# EAGLE design Lora Relay v1.1 (EAGLE 6.1)
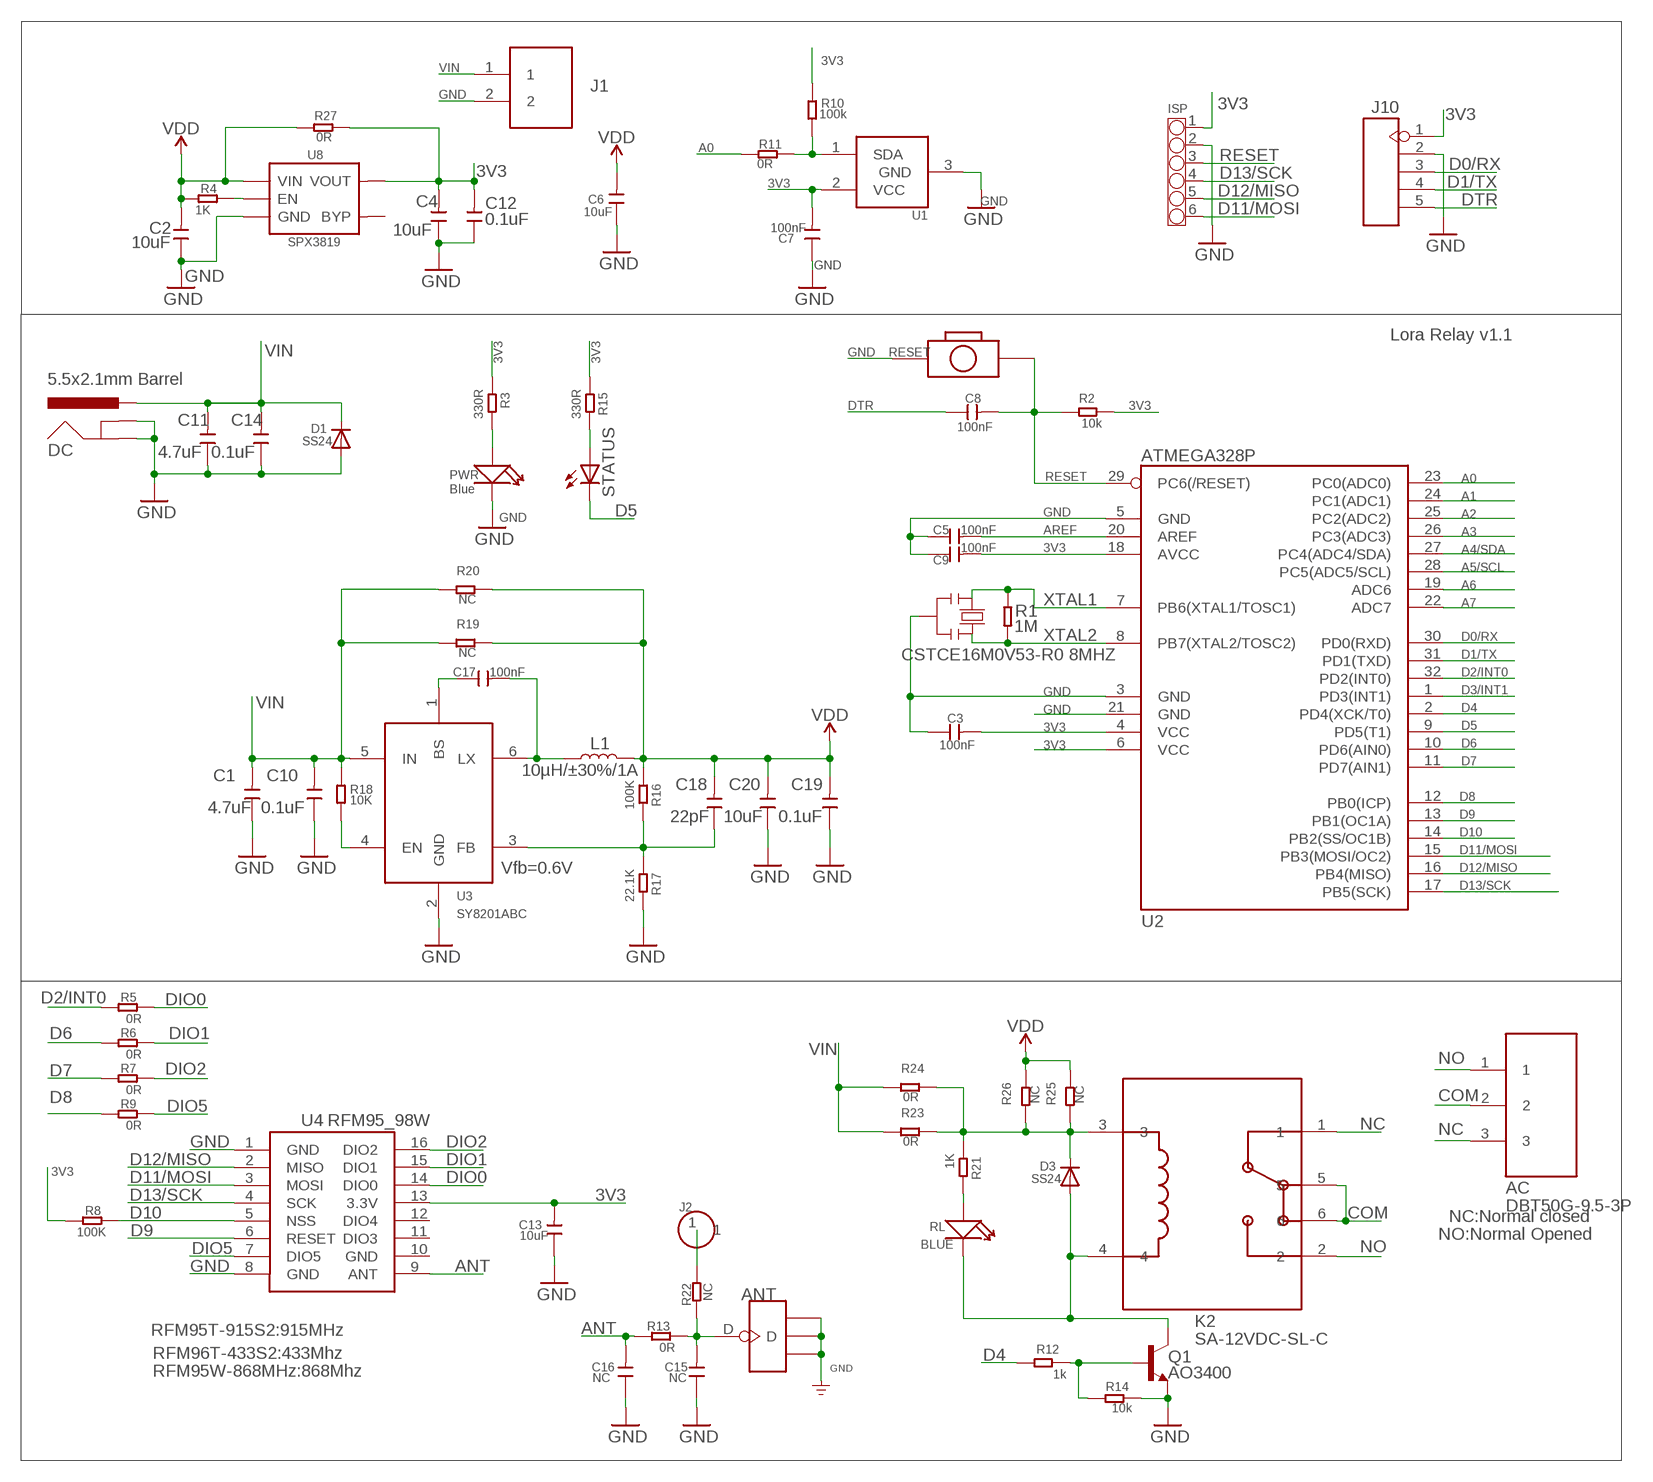
[diagram p0: schematic, sheet 1]

## Parts
AC  DBT50G-9.5-3P  [THROUGH-HOLE-9.5]
ANT  ANTENNA-U-FL  [4P-U-FL]
C1  4.7uF  C-0603  [0603]
C2  10uF  C-0603  [0603]
C3  100nF  C-0603  [0603]
C4  10uF  C-0603  [0603]
C5  100nF  C-0603  [0603]
C6  10uF  C-0603  [0603]
C7  100nF  C-0603  [0603]
C8  100nF  C-0603  [0603]
C9  100nF  C-0603  [0603]
C10  0.1uF  C-0603  [0603]
C11  4.7uF  C-0603  [0603]
C12  0.1uF  C-0603  [0603]
C13  10uF  C-0603  [0603]
C14  0.1uF  C-0603  [0603]
C15  NC  C-0603  [0603]
C16  NC  C-0603  [0603]
C17  100nF  C-0603  [0603]
C18  22pF  C-0603  [0603]
C19  0.1uF  C-0603  [0603]
C20  10uF  C-0603  [0603]
D1  SS24  DIODESMA  [SMADIODE]
D3  SS24  DIODESMA  [SMADIODE]
DC  5.5x2.1mm Barrel  POWER_JACKSMD  [POWER_JACK_SMD]
ISP  CONNECTOR-HEADER-6P-3460270P1  [1X6P-2.54-8.5-BLACK-FEMALE]
J1  PH2.0-2P-90-DIP  [PH2.0-2P-90-DIP]
J2  HEADER-1P-50  [1P-100/50MIL]
J10  HEADER-5P-2.54  [5P-2.54]
K2  SA-12VDC-SL-C  [THROUGH-HOLE]
L1  10µH/±30%/1A  INDUCTOR-CR54-47UH  [CR54]
PWR  Blue  LED'0603'  [LED-0603]
Q1  AO3400  TRANS_NPN-MMBT2222AL  [SOT23-3]
R1  1M  R-0603  [R0603]
R2  10k  R-0603  [R0603]
R3  330R  R-0603  [R0603]
R4  1K  R-0603  [R0603]
R5  0R  R-0603  [R0603]
R6  0R  R-0603  [R0603]
R7  0R  R-0603  [R0603]
R8  100K  R-0603  [R0603]
R9  0R  R-0603  [R0603]
R10  100k  R-0603  [R0603]
R11  0R  R-0603  [R0603]
R12  1k  R-0603  [R0603]
R13  0R  R-0603  [R0603]
R14  10k  R-0603  [R0603]
R15  330R  R-0603  [R0603]
R16  100K  R-0603  [R0603]
R17  22.1K  R-0603  [R0603]
R18  10K  R-0603  [R0603]
R19  NC  R-0603  [R0603]
R20  NC  R-0603  [R0603]
R21  1K  R-0603  [R0603]
R22  NC  R-0603  [R0603]
R23  0R  R-0603  [R0603]
R24  0R  R-0603  [R0603]
R25  NC  R-0603  [R0603]
R26  NC  R-0603  [R0603]
R27  0R  R-0603  [R0603]
RESET  BOTTON-2P-90D  [2P-7.62X3.56-90D]
RL  BLUE  LED'0603'  [LED-0603]
STATUS  LED5MM  [LED5MM]
U1  IC_ATSHA204A_CRYPT  [SOT23-3]
U2  ATMEGA328P  ATMEGA8/168/328  [TQFP32]
U3  SY8201ABC  [SOT-23-6]
U4  RFM95_98W  RFM92_93W  [RFM92_93W]
U8  SPX3819  [SOT23-5]
Y1  CSTCE16M0V53-R0 8MHZ  RESONATORMU  [RESONATOR]

## Nets
3V3: C3.2 C4.2 C7.2 C9.2 C12.2 C13.2 ISP.1 J10.1 R2.1 R3.1 R8.2 R10.1 R15.1 R27.2 U1.2(VCC) U2.4(VCC) U2.6(VCC) U2.18(AVCC) U4.13(3.3V) U8.5(VOUT)
A0: R11.1 U2.23(PC0(ADC0))
A1: U2.24(PC1(ADC1))
A2: U2.25(PC2(ADC2))
A3: U2.26(PC3(ADC3))
A4/SDA: U2.27(PC4(ADC4/SDA))
A5/SCL: U2.28(PC5(ADC5/SCL))
A6: U2.19(ADC6)
A7: U2.22(ADC7)
ANT: C16.2 R13.2 U4.9(ANT)
AREF: C5.2 U2.20(AREF)
COM: AC.2 K2.5 K2.6
D0/RX: J10.3 U2.30(PD0(RXD))
D1/TX: J10.4 U2.31(PD1(TXD))
D2/INT0: R5.1 U2.32(PD2(INT0))
D3/INT1: U2.1(PD3(INT1))
D4: R12.2 U2.2(PD4(XCK/T0))
D5: STATUS.K(C) U2.9(PD5(T1))
D6: R6.1 U2.10(PD6(AIN0))
D7: R7.1 U2.11(PD7(AIN1))
D8: R9.1 U2.12(PB0(ICP))
D9: U2.13(PB1(OC1A)) U4.6(RESET)
D10: R8.1 U2.14(PB2(SS/OC1B)) U4.5(NSS)
D11/MOSI: ISP.6 U2.15(PB3(MOSI/OC2)) U4.3(MOSI)
D12/MISO: ISP.5 U2.16(PB4(MISO)) U4.2(MISO)
D13/SCK: ISP.4 U2.17(PB5(SCK)) U4.4(SCK)
DIO0: R5.2 U4.14(DIO0)
DIO1: R6.2 U4.15(DIO1)
DIO2: R7.2 U4.16(DIO2)
DIO5: R9.2 U4.7(DIO5)
DTR: C8.1 J10.5
GND: ANT.GND1 ANT.GND2 ANT.GND3 C1.1 C2.1 C3.1 C4.1 C5.1 C6.1 C7.1 C9.1 C10.1 C11.1 C12.1 C13.1 C14.1 C15.1 C16.1 C19.1 C20.1 D1.A DC.GND(GNDBREAK) DC.P$4(GND) ISP.2 J1.2 J10.2 PWR.- Q1.2(E) R14.2 R17.2 RESET.P$1 U1.3(GND) U2.3(GND) U2.5(GND) U2.21(GND) U3.2(GND) U4.1(GND) U4.8(GND) U8.2(GND) Y1.2
N$1: D3.A K2.4 Q1.3(C) RL.-
N$2: R10.2 R11.2 U1.1(SDA)
N$3: Q1.1(B) R12.1 R14.1
N$4: ANT.D C15.2 R13.1 R22.2
N$5: R15.2 STATUS.A
N$6: C17.2 L1.P$1 U3.6(LX)
N$7: PWR.+ R3.2
N$8: C17.1 U3.1(BS)
N$9: R21.2 RL.+
N$10: C18.1 R16.2 R17.1 U3.3(FB)
N$11: R18.2 U3.4(EN)
N$12: J2.1 R22.1
N$13: D3.C K2.3 R21.1 R23.2 R24.2 R25.1 R26.1
N$24: R4.2 U8.3(EN)
NC: AC.3 K2.1
NO: AC.1 K2.2
RESET: C8.2 ISP.3 R2.2 RESET.P$2 U2.29(PC6(/RESET))
VDD: C2.2 C6.2 C18.2 C19.2 C20.2 L1.P$2 R4.1 R16.1 R19.2 R20.2 R25.2 R26.2 R27.1 U8.1(VIN)
VIN: C1.2 C10.2 C11.2 C14.2 D1.C DC.VIN0(PWR) J1.1 R18.1 R19.1 R20.1 R23.1 R24.1 U3.5(IN)
XTAL1: R1.2 U2.7(PB6(XTAL1/TOSC1)) Y1.1
XTAL2: R1.1 U2.8(PB7(XTAL2/TOSC2)) Y1.3
Unconnected: U4.11(DIO3) U4.12(DIO4) U8.4(BYP)

## Notes on the sheet
- J1
- Lora Relay v1.1
- Vfb=0.6V
- NC:Normal closed
- NO:Normal Opened
- RFM95T-915S2:915MHz
- RFM96T-433S2:433Mhz
- RFM95W-868MHz:868Mhz

## Power pins joined to a net without a drawn wire
GND: U4.10(GND)

## Library data of the parts
AC = self:DBT50G-9.5-3P
ANT = Connector:ANTENNA-U-FL
C1-C20 = Discrete:C*: Ceramic Capacitors
D1 D3 = adafruit:DIODE: Diode SMADIODE - SMA Surface Mount Package 20V 1A Schottky Diode Digikey: 641-1014-6-ND DO-1N4148 - Through Hole Small Current Diode SOD-123 20V 1 A (.5mV Vf) Schottky Diode - Digikey: MBRX120TPMSCT-ND SOD-323 10V 570mA (.38mV Vf, 3ns) Schottky Diode - Digikey: ZLLS410CT-ND SOD-523 30V 30mA Schottky Diode (RB751S-40TE61) - Digikey: RB751S-40TE61CT-ND SOT23-R/W - SOT23 Package (R = Solder Paste/Reflow Ovens, W = Hand-Soldering) BAT54Film 40V 300mA - Digikey: 497-7162-1-ND
DC = SparkFun-Connectors:POWER_JACK: Power Jack Connector This is the standard 5.5mm barrel jack for power. The PTH is the most common, proven, reliable, footprint. The Slot footprint only works if the mill layer is transmitted to the PCB fab house so be warned. Here are the connectors we sell at SparkFun: DC Barrel Power Jack/Connector <https://www.sparkfun.com/products/119> (PRT-00119) DC Barrel Power Jack/Connector (SMD) <https://www.sparkfun.com/products/12748> (PRT-12748) DC Barrel Jack Adapter - Breadboard Compatible <https://www.sparkfun.com/products/10811> (PRT-10811) It is used on this SparkFun product (and many, many others): SparkFun RedBoard - Programmed with Arduino <https://www.sparkfun.com/products/12757> (DEV-12757) Also, if you need a mating power supply or connector, please check these out: Wall Adapter Power Supply - 9VDC 650mA <https://www.sparkfun.com/products/298> (TOL-00298) DC Barrel Jack Adapter - Male <https://www.sparkfun.com/products/10287> (PRT-10287); PROD_ID: CONN-08106; SF_ID: PRT-12748
ISP = OPL Eagle Library:CONNECTOR-HEADER-6P
J1 = Connector:PH2.0-2P-90-DIP
J2 = Connector:HEADER-1P
J10 = Connector:HEADER-5P
K2 = self:SA-12VDC-SL-C
L1 = SparkFun-Coils:INDUCTOR: Inductors Resist changes in electrical current. Basically a coil of wire. SparkFun Products: SparkFun Load Cell Amplifier - HX711 <https://www.sparkfun.com/products/13879> IOIO-OTG - V2.2 <https://www.sparkfun.com/products/13613>; PROD_ID: NDUC-10789; VALUE: 47µH/±30%/750mA
PWR RL = Discrete:LED*
Q1 = SparkFun-DiscreteSemi:TRANS_NPN: NPN transistor Current controlled devices typically used to amplify current or used as a switch. BC547 - COM-08928 <http://www.sparkfun.com/products/8928> (TO-92 45V 100mA) (1.Collector 2.Base 3.Emitter) 2N3904 - COM-00521 <http://www.sparkfun.com/products/521> (TO-92 40V 200mA) (1.Emitter 2.Base 3.Collector) P2N2222A - COM-12852 <http://www.sparkfun.com/products/12852> (TO-92 40V 600mA) (1.Collector 2.Base 3.Emitter); PROD_ID: TRANS-08049; VALUE: 600mA/40V
R1-R27 = Discrete:R*
RESET = Discrete:BOTTON-2P
STATUS = led:LED: LED OSRAM: - CHIPLED LG R971, LG N971, LY N971, LG Q971, LY Q971, LO R971, LY R971 LH N974, LH R974 LS Q976, LO Q976, LY Q976 LO Q996 - Hyper CHIPLED LW Q18S LB Q993, LB Q99A, LB R99A - SideLED LS A670, LO A670, LY A670, LG A670, LP A670 LB A673, LV A673, LT A673, LW A673 LH A674 LY A675 LS A676, LA A676, LO A676, LY A676, LW A676 LS A679, LY A679, LG A679 - Hyper Micro SIDELED® LS Y876, LA Y876, LO Y876, LY Y876 LT Y87S - SmartLED LW L88C, LW L88S LB L89C, LB L89S, LG L890 LS L89K, LO L89K, LY L89K LS L896, LA L896, LO L896, LY L896 - TOPLED LS T670, LO T670, LY T670, LG T670, LP T670 LSG T670, LSP T670, LSY T670, LOP T670, LYG T670 LG T671, LOG T671, LSG T671 LB T673, LV T673, LT T673, LW T673 LH T674 LS T676, LA T676, LO T676, LY T676, LB T676, LH T676, LSB T676, LW T676 LB T67C, LV T67C, LT T67C, LS T67K, LO T67K, LY T67K, LW E67C LS E67B, LA E67B, LO E67B, LY E67B, LB E67C, LV E67C, LT E67C LW T67C LS T679, LY T679, LG T679 LS T770, LO T770, LY T770, LG T770, LP T770 LB T773, LV T773, LT T773, LW T773 LH T774 LS E675, LA E675, LY E675, LS T675 LS T776, LA T776, LO T776, LY T776, LB T776 LHGB T686 LT T68C, LB T68C - Hyper Mini TOPLED® LB M676 - Mini TOPLED Santana® LG M470 LS M47K, LO M47K, LY M47K Source: http://www.osram.convergy.de LUXEON: - LUMILED® LXK2-PW12-R00, LXK2-PW12-S00, LXK2-PW14-U00, LXK2-PW14-V00 LXK2-PM12-R00, LXK2-PM12-S00, LXK2-PM14-U00 LXK2-PE12-Q00, LXK2-PE12-R00, LXK2-PE12-S00, LXK2-PE14-T00, LXK2-PE14-U00 LXK2-PB12-K00, LXK2-PB12-L00, LXK2-PB12-M00, LXK2-PB14-N00, LXK2-PB14-P00, LXK2-PB14-Q00 LXK2-PR12-L00, LXK2-PR12-M00, LXK2-PR14-Q00, LXK2-PR14-R00 LXK2-PD12-Q00, LXK2-PD12-R00, LXK2-PD12-S00 LXK2-PH12-R00, LXK2-PH12-S00 LXK2-PL12-P00, LXK2-PL12-Q00, LXK2-PL12-R00 Source: www.luxeon.com KINGBRIGHT: KA-3528ASYC Source: www.kingbright.com
U1 = TD-MySensors:IC_ATSHA204A_CRYPT
U2 = IC:ATMEGA8/168/328: MICROCONTROLLER
U3 = self:SY8201ABC
U4 = dragino:RFM92_93W
U8 = IC:SPX3819
Y1 = SmartPrj:RESONATOR

## Net classes
0 default: width 0.152 mm, drill 0.305 mm, clearance 0.152 mm
2 gnd: width 0.305 mm, drill 0.559 mm, clearance 0.254 mm
3 usbvcc: width 0.508 mm, drill 0.61 mm, clearance 0.254 mm

## Board
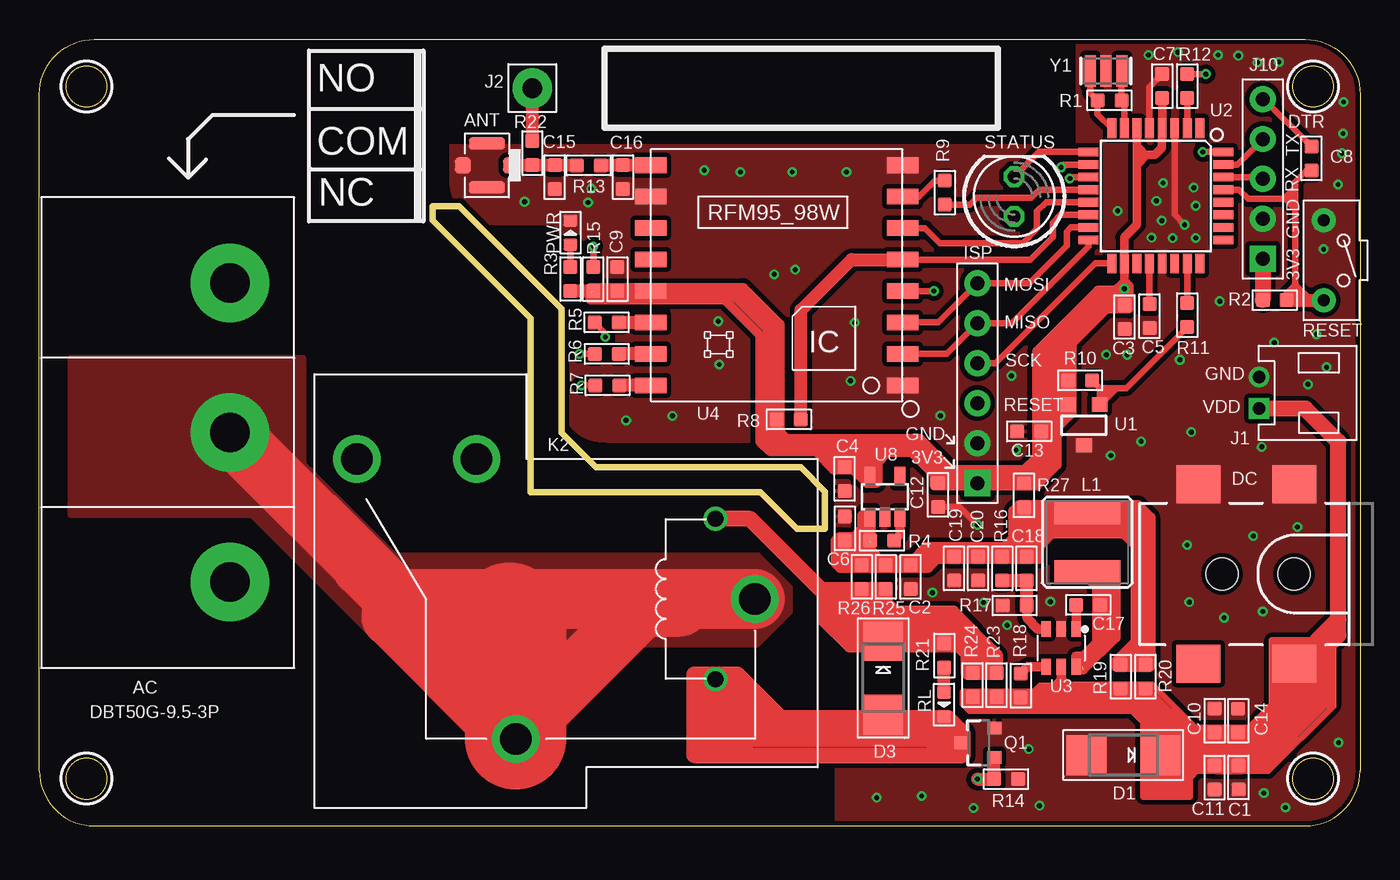
[diagram p1: board, top side]
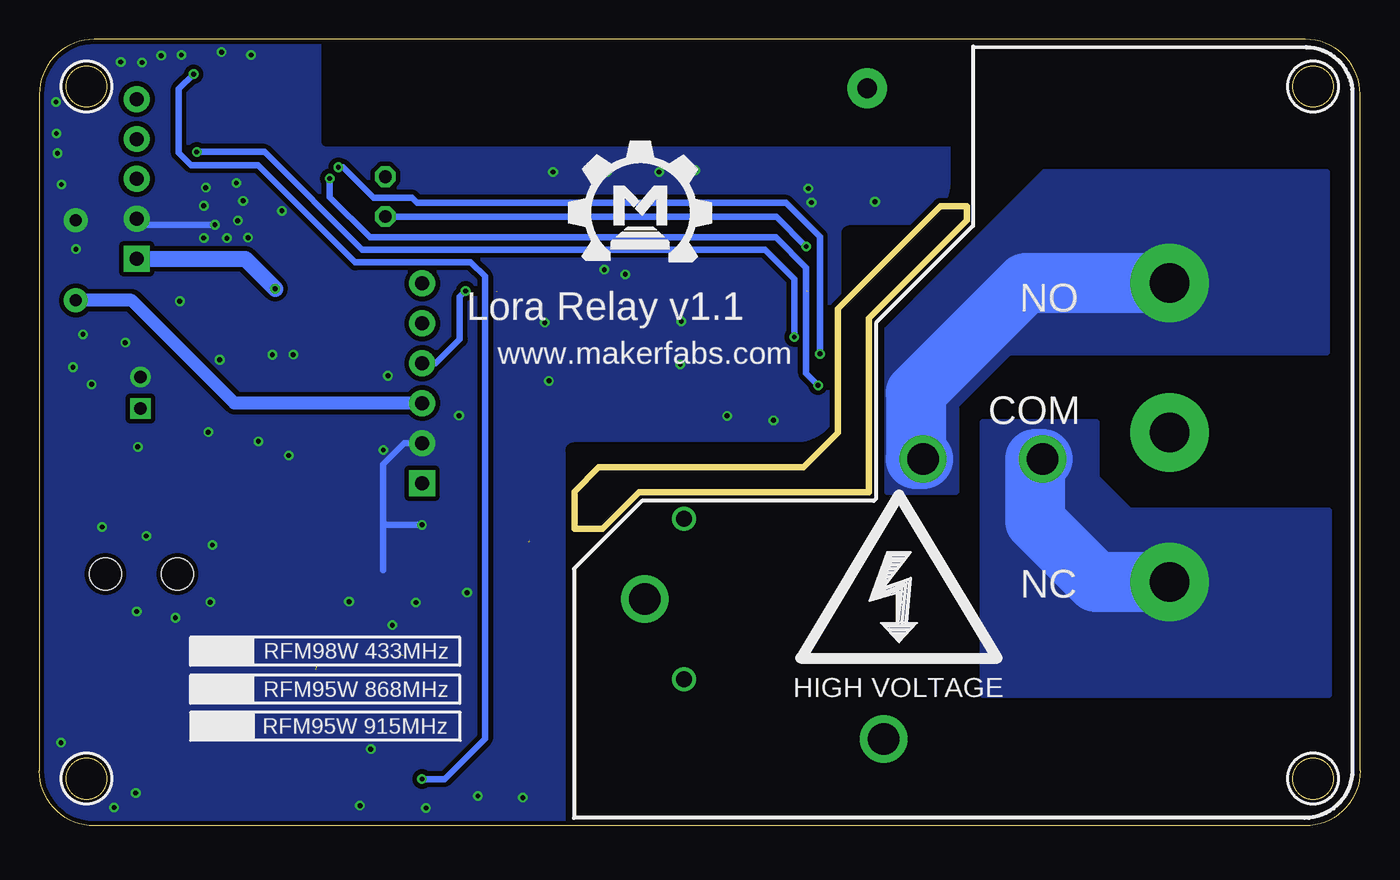
[diagram p2: board, bottom side, seen from below]

Size 84 x 50 mm. Coordinates in mm from the lower left corner, seen from the top.
Outline: 49.96,18.9 49.96,21.25 48.42,22.78 35.41,22.78 33.21,24.98 33.21,32.89 26.71,39.39 26.71,39.39 25,39.39 25,38.49 31.24,32.26
Outline: 31.24,32.16 31.24,21.2
Outline: 31.24,21.2 31.24,21.2
Outline: 48.19,18.9 49.9,18.9
Outline: 48.16,18.9 45.87,21.2 31.24,21.2
Outline: 0,3.5 0,46.5 arc-90 3.5,50 80.5,50 arc-90 84,46.5 84,3.5 arc-90 80.5,0 3.5,0 arc-90 0,3.5
Outline: circle at 81,3 radius 1.3
Outline: circle at 81,47 radius 1.3
Outline: circle at 3,3 radius 1.3
Outline: circle at 3,47 radius 1.3
Copper layers (1*16): Top 0.035mm / dielectric 1.5mm / Bottom 0.035mm
Design rules: minimum track width 6mil, minimum drill 12mil, track to track 6mil, track to pad 6mil, pad to pad 6mil, via to via 6mil, smd to smd 0mil, copper to edge 10mil, drill to drill 10mil, minimum pad ring 10mil, minimum via ring 6mil, stop-mask expansion 2mil, vias tented up to drill 100mil, thermal gap 0mil
tRestrict: area 24,43.7 to 65.6,49.9; 11 lines
bRestrict: area 24,43.5 to 65.8,49.9; 10 lines

### Footprints (pad centres in the part's own frame; a part is rotated, then mirrored left to right if it is on the bottom)
THROUGH-HOLE-9.5 = drill 2.5 pad 5: 1 -9.5,0; 2 0,0; 3 9.5,0
4P-U-FL = smd 1.016 x 1.016: D -1.524,0; GND3 1.524,0 | smd 2.286 x 0.762: GND1 0,1.397; GND2 0,-1.397
0603 = smd 0.889 x 0.889: 1 -0.762,0; 2 0.762,0
SMADIODE = smd 2.54 x 2.54: A 2.349,0; C -2.349,0
POWER_JACK_SMD = smd 2.8 x 2.4: GND 0,-5.7; P$4 6.1,-5.7; VIN0 0,5.7; VIN1 6.1,5.7 | hole 2.032: 0,0; 4.572,0
1X6P-2.54-8.5-BLACK-FEMALE = drill 0.889 pad 1.651 square: 1 0,6.35 | drill 0.889 pad 1.651: 2 0,3.81; 3 0,1.27; 4 0,-1.27; 5 0,-3.81; 6 0,-6.35
PH2.0-2P-90-DIP = drill 0.8 square: 1 0,1 | drill 0.8: 2 0,-1
1P-100/50MIL = drill 1.27 pad 2.54: 1 0,0
5P-2.54 = drill 0.889 pad 1.651 square: 1 0,5.08 | drill 0.889 pad 1.651: 2 0,2.54; 3 0,0; 4 0,-2.54; 5 0,-5.08
THROUGH-HOLE = drill 2: 1 8.9,13.3; 2 8.9,5.7; 5 -8.9,3.2; 6 0,-12 | drill 1: 3 5.1,-9.5; 4 -5.1,-9.5
CR54 = smd 4.2 x 1.4: P$1 0,1.85; P$2 0,-1.85
LED-0603 = smd 0.762 x 0.889: + -0.762,0; - 0.762,0
SOT23-3 = smd 0.8 x 0.9: 1 -0.95,-1; 2 0.95,-1; 3 0,1.1
R0603 = smd 0.889 x 0.889: 1 -0.762,0; 2 0.762,0
2P-7.62X3.56-90D = drill 0.762 pad 1.524: P$1 0,2.54; P$2 0,-2.54
LED5MM = drill 0.813 octagon: A -1.27,0; K 1.27,0
SOT23-3' = smd 1 x 0.9: 1 -1,-1.3; 2 1,-1.3; 3 0,1.3
TQFP32 = smd 1.27 x 0.559: 1 -4.293,2.8; 2 -4.293,2; 3 -4.293,1.2; 4 -4.293,0.4; 5 -4.293,-0.4; 6 -4.293,-1.2; 7 -4.293,-2; 8 -4.293,-2.8; 17 4.293,-2.8; 18 4.293,-2; 19 4.293,-1.2; 20 4.293,-0.4; 21 4.293,0.4; 22 4.293,1.2; 23 4.293,2; 24 4.293,2.8 | smd 0.559 x 1.27: 9 -2.8,-4.293; 10 -2,-4.293; 11 -1.2,-4.293; 12 -0.4,-4.293; 13 0.4,-4.293; 14 1.2,-4.293; 15 2,-4.293; 16 2.8,-4.293; 25 2.8,4.293; 26 2,4.293; 27 1.2,4.293; 28 0.4,4.293; 29 -0.4,4.293; 30 -1.2,4.293; 31 -2,4.293; 32 -2.8,4.293
SOT-23-6 = smd 1 x 0.6: 1 -1.2,0.95; 2 -1.2,0; 3 -1.2,-0.95; 4 1.2,-0.95; 5 1.2,0; 6 1.2,0.95
RFM92_93W = smd 2 x 1: 1 -8,7; 2 -8,5; 3 -8,3; 4 -8,1; 5 -8,-1; 6 -8,-3; 7 -8,-5; 8 -8,-7; 9 8,-7; 10 8,-5; 11 8,-3; 12 8,-1; 13 8,1; 14 8,3; 15 8,5; 16 8,7
SOT23-5 = smd 0.69 x 1.2: 1 -0.95,-1.3; 2 0,-1.3; 3 0.95,-1.3; 4 0.95,1.3; 5 -0.95,1.3
RESONATOR = smd 0.7 x 2: 1 -1,0; 2 0,0; 3 1,0

### Placement (x,y rotation side)
AC  12.12,25 270 top
ANT  28.46,41.99 180 top
C1  76.26,3.07 90 top
C2  55.41,15.83 90 top
C3  69,32.35 90 top
C4  51.21,22.06 90 top
C5  70.59,32.4 90 top
C6  51.23,18.91 270 top
C7  71.41,47.03 270 top
C8  80.89,42.43 270 top
C9  36.77,34.76 270 top
C10  74.74,6.69 270 top
C11  74.74,3.07 90 top
C12  57.16,21.04 90 top
C13  62.96,25.08 0 top
C14  76.24,6.68 270 top
C15  32.77,41.23 90 top
C16  37.12,41.23 90 top
C17  66.7,14.05 0 top
C18  62.79,16.37 90 top
C19  58.17,16.37 90 top
C20  59.7,16.37 90 top
D1  68.94,4.5 180 top
D3  53.67,9.41 270 top
DC  79.8,16.01 180 top
ISP  59.65,28.14 180 top
J1  77.56,27.53 180 top
J2  31.35,46.89 0 top
J10  77.81,41.12 180 top
K2  33.5,14.42 90 top
L1  66.65,18.03 180 top
PWR  33.77,37.71 90 top
Q1  59.73,5.28 90 top
R1  68.05,46.11 0 top
R2  78.57,33.42 0 top
R3  33.78,34.76 90 top
R4  53.59,18.13 0 top
R5  36.08,32 0 top
R6  36.09,30 0 top
R7  36.13,28 0 top
R8  47.67,25.84 180 top
R9  57.58,40.26 90 top
R10  66.19,28.32 0 top
R11  73,32.46 270 top
R12  72.99,47.02 270 top
R13  34.94,41.99 0 top
R14  61.48,2.97 0 top
R15  35.22,34.76 90 top
R16  61.24,16.37 270 top
R17  62.02,14.01 180 top
R18  62.41,8.92 90 top
R19  68.77,9.49 90 top
R20  70.35,9.49 90 top
R21  57.55,10.82 270 top
R22  31.35,42.76 270 top
R23  60.87,8.94 90 top
R24  59.34,8.95 90 top
R25  53.83,15.82 90 top
R26  52.3,15.82 90 top
R27  62.62,21.01 90 top
RESET  81.67,35.95 0 top
RL  57.54,7.71 270 top
STATUS  62,40 90 top
U1  [SOT23-3']  66.43,25.49 180 top
U2  71,40.04 270 top
U3  64.98,11.31 270 top
U4  46.9,35 180 top
U8  53.78,20.92 0 top
U$1  [MAKERFABS_0.3]  49.9,35.91 0 bottom
U$3  [HIGH-VOLTAGE-1.5]  29.33,13.78 0 bottom
Y1  67.83,47.99 180 top

### Tracks (layer width: path | path; a pad name or v marks a point on that pad's centre or on a via)
3V3  (via drill 0.3)  (1 unrouted)
  Top 0.406: ISP.1 59.67,21.77 R27.2 63.72,22.88 C13.2 U1.2 65.43,28.31 R10.1 65.42,31.3 67.23,33.11 C3.2 v69,34.14 | 69,35.21 U2.18 | U2.4 71.41,44.34 | R2.1 | 69.87,43.16 69.95,43.16 70.44,42.66 | 70.44,42.66 70.44,42.55 69.88,41.98 | 70.44,42.66 70.47,42.66 70.49,42.65 | R3.1
  Top 0.55: 71.41,44.34 C7.2 | U2.6 69.8,42.65 | 69.8,42.65 69.8,38.21 68.99,37.4 U2.18 | U2.4 71.4,43.11 70.93,42.65 70.49,42.65 69.8,42.65 | v69,34.14 69,35.21
  Top 0.61: 35.11,33.95 35.39,34.22 | 35.39,34.22 35.88,34.22 | 35.88,34.22 44.78,34.22 47.11,31.89 47.11,25.04 47.56,24.6 56.04,24.6 58,22.64 62.62,22.64 63.42,23.45 63.42,30.16 67.31,34.04 68.46,34.04 68.94,34.51 69.13,34.51 69.3,34.34 69.3,32.87 67.88,32.87 65.66,30.64 65.66,26.23 64.72,25.29 64.72,22.92 63.43,21.63 56.92,21.63 56.92,22.27 55.45,23.74 53.95,23.74 53.33,23.12 53.33,21.85 53.25,21.77 52.63,21.77 51.75,22.65 50.51,22.65 49.35,23.8 46.45,23.8 45.84,24.41 45.84,31.18 43.57,33.45 35.06,33.45 35.02,33.49 35.02,34.2 35.05,34.22 35.39,34.22 | 35.88,34.22 36.45,33.65 44.26,33.65 44.33,33.58 44.33,33.49 46.33,31.5 46.33,24.5 46.63,24.2 49.43,24.2 50.93,22.7 52.47,22.7 52.06,23.1 51.76,23.1 51.41,23.45 50.48,23.45 50.49,23.45 52.57,23.45 52.68,23.55 53.41,23.55 54.02,24.16 55.5,24.16 57.34,22.32 59.69,22.32 59.59,22.42 57.53,22.42 57.82,22.13 60.14,22.13 60.14,22.12 62.68,22.12 63.47,22.91 63.47,22.94 63.24,22.71 63.24,22.04 64.14,22.94 64.14,25.23 65.2,26.29 64.5,26.29 63.87,25.66 63.87,29.88 67.56,33.57 68.5,33.57 68.84,33.91 68.52,33.91 64.32,29.7 64.32,26.62 64.18,26.48 64.62,26.48 64.92,26.77 64.92,29.45 64.85,29.53 64.85,29.62 65.2,29.97 65.2,27.17 65,26.97
  Top 0.813: ISP.1 57.17,21.79 C12.2 57.16,22.8 55.84,24.11 52.54,24.11 | 52.54,24.11 51.08,24.11 | 51.08,24.11 47.3,24.11 46.91,24.5 R8.2 46.92,31.83 44.75,34 U4.13 C9.2 R15.1 | C4.2 51.21,23.98 51.08,24.11 | U8.5 52.83,23.82 52.54,24.11 | R15.1 | R15.1 R3.1
  Top 1.016: J10.1 R2.1
  Bottom 1.016: J10.1 70.9,36.04 v69,34.14
A0
  Top 0.406: U2.23 R11.1
ANT
  Top 0.8: U4.9 C16.2 | C16.2 R13.2
  Top 0.813: C16.2 | R13.2
AREF
  Top 0.406: U2.20 C5.2
COM
  Top 3.81: AC.2 22.7,14.42 K2.6 | 20.52,16.5 22.39,14.62 22.39,13.28 29.77,5.9 30.31,5.9 38.35,13.94 40.71,13.94 | 29.18,10.02 27.61,11.6 26.77,11.6
  Top 6.452: K2.5 30.3,13.12 29.91,13.51
  pour Top: 2,29.72 16.77,29.72 16.77,23 22.6,17.18 45.71,17.18 47.7,15.18 47.7,13.57 45.68,11.54 21.73,11.54 13.49,19.79 2,19.79
D0/RX
  Top 0.406: U2.30 77.69,41.24 J10.3
D1/TX
  Top 0.406: U2.31 76.19,42.04 J10.4
D2/INT0  (via drill 0.3)
  Top 0.406: R5.1 35.99,31.33 v35.99,31.08 | v73.99,42.84 U2.32
  Bottom 0.406: v35.99,31.08 35.99,34.76 37.84,36.62 63.46,36.62 69.68,42.84 v73.98,42.84 v73.99,42.84
D4
  Top 0.406: U2.2 72.99,44.34 R12.2
D5
  Top 0.406: U2.9 63.57,42.84 STATUS.K
D6  (via drill 0.3)
  Top 0.406: R6.1 v34.36,30 | v64.98,41.87 65.16,42.04 U2.10
  Bottom 0.406: v34.36,30 34.36,37.46 36.51,39.61 59.98,39.61 60.3,39.93 62.75,39.93 64.68,41.87 v64.98,41.87
D7  (via drill 0.3)
  Top 0.406: R7.1 v34.48,28 v34.48,28.01 | v65.53,41.15 65.62,41.24 U2.11
  Bottom 0.406: v34.48,28.01 35.24,28.77 35.24,35.48 37.16,37.41 62.98,37.41 65.53,39.96 v65.53,41.15
D8
  Top 0.406: R9.1 59.18,39.49 59.62,39.93 63.09,39.93 63.6,40.44 66.24,40.44 U2.12
D9
  Top 0.406: U2.13 64.03,39.64 63.45,39.06 63.45,37.97 62.53,37.05 57.27,37.05 56.33,37.99 U4.6
D10
  Top 0.406: U2.14 64.94,38.84 64.46,38.35 64.46,37.43 63.02,36 U4.5
  Top 0.813: R8.1 48.43,32.78 51.65,36 U4.5
D11/MOSI
  Top 0.406: U2.15 65.61,38.04 65.34,37.77 65.34,36.86 62.97,34.49 ISP.6 57.16,32 U4.3
D12/MISO
  Top 0.406: U2.16 66.71,36.81 61.84,31.94 ISP.5 57.7,30 U4.2
D13/SCK  (via drill 0.3)  (1 unrouted)
  Top 0.406: U2.17 67.14,35.75 60.81,29.42 59.66,29.42 ISP.4 | v56.89,34 54.93,34 54.9,33.97
  Bottom 0.406: ISP.4 58.79,29.41 57.27,30.93 57.27,33.62 v56.89,34
DIO0
  Top 0.813: R5.2 U4.14
DIO1
  Top 0.813: U4.15 R6.2
DIO2
  Top 0.813: U4.16 R7.2
DIO5
  Top 0.406: U4.7 55.95,40 56.97,41.02 R9.2
DTR
  Top 0.406: J10.5 77.88,46.2 C8.1
GND  (via drill 0.3)
  Top 0.406: C12.1 58.52,20.28 v59.66,19.14 | U2.3 72.2,38.84 v72.83,38.21 | U2.5 70.6,46.98 C7.1
  Bottom 0.406: ISP.2 60.79,24.33 62.12,23 62.12,16.26 | v59.66,19.14 62.02,19.14 62.04,19.12 | v72.83,38.21 77.42,38.21 J10.2
  other vias: 60.04,14.2 30.86,39.68 34.89,39.63 35.09,40.52 44.59,41.57 47.88,41.57 51.33,41.57 42.28,41.68 46.74,35.06 43.24,29.33 43.17,32.08 51.86,31.99 51.59,28.29 40.26,26.06 37.31,25.78 48.07,35.36 57.3,26.08 81.86,29.15 73.26,25.02 77.73,24.1 72.98,17.86 73.13,14.22 79.25,1.17 77.87,2.09 82.63,5.29 77.2,18.42 77.8,13.62 80.01,19 64.3,14.26 68.14,23.55 69.18,29.95 71.47,40.86 68.57,39.09 71.38,38.47 73.54,37.37 73.42,40.57 81.67,36.66 82.58,40.77 82.91,44.02 82.85,42.76 82.94,46.01 78.82,48.56 76.25,48.96 77.46,48.53 72.41,49.19 70.54,49.01 74.96,49.01 67.85,29.96 70.06,24.44 62.12,23.9 61.55,12.76 56.8,14.83 73.54,39.42 70.73,37.4 71.04,39.73 72.07,37.36 75.06,33.35 72.53,29.63 78.53,30.72 80.67,28.06 81.22,31.24 61.82,28.61 63.6,1.29 53.26,1.79 56.12,1.9 59.41,1.14 62.92,4.88 75.35,13.23
  pour Bottom (isolate 0.305): -26,-1.15 99.11,-1.16 99.23,75.17 -25.88,75.17
  pour Top (isolate 0.305): -26.02,-1.18 97.14,-1.1 97.26,71.91 -25.9,71.83
N$1
  Top 0.61: 57.77,6.85 58.09,6.53 58.09,5.82 | D3.A 53.53,6.93 53.53,6.23
  Top 0.813: 53.88,6.95 RL.- 57.54,6.37 58.09,5.82 Q1.3 | 53.88,6.95 45.84,6.95 | 53.66,6.74 53.88,6.95
  Top 1.016: 41.64,9.41 41.64,4.49 58.73,4.49 58.73,5.88 57.77,6.85 47.16,6.85 44.39,9.62 41.64,9.62 41.64,8.04 42.41,8.04 42.41,8.97 42.99,8.97 | 42.99,8.97 42.99,9 | 42.99,8.97 42.99,8.83 45.58,6.23 53.53,6.23 56.93,6.23 58.09,5.07 57.02,5.07 56.6,5.5 45.13,5.5 42.77,7.87 42.43,7.87 42.39,7.83 42.39,5.36 42.59,5.16 44.82,5.16 44.88,5.1 44.52,5.1 42.85,6.77 42.85,5.93 43.22,5.57
  Top 1.27: K2.4 43.47,9.32 45.84,6.95
N$2
  Top 0.406: U1.1 67.43,27.83 | 67.43,27.83 R10.2 | 67.43,27.83 68.53,27.83 | R11.2 69.13,27.83 68.81,27.83 68.53,27.83 | 67.53,26.82 68.53,27.83 | 68.53,27.83 68.13,27.83 67.63,27.33
N$3  (via drill 0.3)
  Top 0.406: R12.1 v74.18,47.79 v74.18,47.78 | 60.59,3.62 60.72,3.48
  Top 0.813: Q1.1 60.72,3.48 R14.1 v59.66,2.98
  Bottom 0.406: v59.66,2.98 58.23,2.98 55.66,5.55 55.66,34.93 56.56,35.83 63.91,35.83 70.09,42 74.34,42 75.12,42.78 75.12,46.84 v74.18,47.78
N$4
  Top 0.8: R13.1 C15.2 | C15.2 R22.2 | R22.2 ANT.D
  Top 0.813: C15.2 | R22.2 | ANT.D
N$5  (via drill 0.3)
  Top 0.406: v35.23,36.83 35.23,35.53 R15.2
  Bottom 0.406: STATUS.A 37.14,38.73 v35.23,36.83
N$6  (1 unrouted)
  Top 0.254: 67.47,15.51 67.32,15.51 L1.P$1
  Top 0.61: 67.47,15.51 C17.2 67.47,11.21 66.36,10.11 U3.6 | 65.09,16.45 65.98,16.45 67.26,15.16 67.26,11.66 66.38,10.78 65.92,10.78 65.92,9.91 66.39,9.91 68.45,11.96 68.45,16.09 67.94,15.59 67.94,11.84 66.42,10.33 66.16,10.33
N$7
  Top 0.406: R3.2 PWR.+
N$8
  Top 0.61: C17.1 U3.1
N$9
  Top 0.406: 57.54,10.05 R21.2
  Top 0.813: RL.+ 57.54,10.05
N$10
  Top 0.61: R17.1 62.79,13.22 63.5,12.51 U3.3
  Top 0.813: R16.2 C18.1 R17.1
N$11
  Top 0.61: U3.4 62.84,10.11 R18.2
N$12
  Top 0.813: R22.1 J2.1
N$13  (1 unrouted)
  Top 0.406: R21.1 56.28,12.85
  Top 0.61: R24.2 59.34,11.36 | 53.72,14.98 53.72,15.16 53.68,15.2 49.7,15.2 49.53,15.37 49.53,15.31 50.34,14.51 50.34,14.72 50.36,14.74 53.75,14.74 53.97,14.96 53.97,14.23 54.51,13.69 58.15,13.69 60.95,10.88 60.95,9.6 60.93,9.57 59.01,9.57 58.89,9.69 58.89,10.83 58.41,11.32 51.47,11.32 49.75,13.04 49.75,14.87 50.03,15.15 50.19,15.15 51.13,14.2 53.46,14.2 53.58,14.09 50.48,14.09 50.23,13.84 50.23,13.33 50.18,13.27 50.18,13.23 51.65,11.76 | 51.65,11.76 56.95,11.76 57.16,11.55 57.08,11.55 56.39,12.24 52.48,12.24 | 52.48,12.24 51.6,12.24 50.51,13.34 57.82,13.34 60.33,10.83 60.33,10.04 60.25,9.96 59.89,9.96 59.86,9.99 59.86,10.77 57.69,12.94 56.46,12.94 56.42,12.98 56.55,12.98 57.46,12.07 58.23,12.07 58.24,12.06 57.97,12.06 57.44,12.58 | D3.C 54.65,12.75 56.27,12.75 56.26,12.73 52.14,12.73 51.63,13.24 51.63,13.71 51.65,13.69 52.59,13.69 | 52.59,13.69 53.05,13.69 | 53.05,13.69 53.89,13.69 | 51.65,11.76 52.59,12.7 52.59,13.69 | 51.87,12.85 52.48,12.24 | R25.1 53.05,14.28 53.05,13.69
  Top 0.813: R21.1 59.12,11.58 | 59.12,11.58 60.11,11.58 60.87,10.83 R23.2 | 59.26,11.44 59.12,11.58 | R26.1 R25.1
  Top 1.016: 59.34,11.36 59.26,11.44 | 51.87,12.85 45.2,19.52 K2.3
N$24
  Top 0.61: U8.3 54.73,18.5 R4.2
NC
  Bottom 3.81: AC.3 16.78,15.5 20.66,19.38 20.66,23.32 K2.1
  pour Bottom: 2,8.35 23.98,8.35 23.98,25.66 16.78,25.66 16.78,22.16 14.66,20.04 2,20.04
NO
  Bottom 3.81: AC.1 21.29,34.5 28.26,27.53 28.26,23.33 K2.2
  pour Bottom: 2.13,41.55 20.08,41.55 30.05,31.57 30.05,21.22 26.11,21.22 25.71,21.22 25.71,26.7 22.31,30.11 5.01,30.11 2.13,30.11 2.13,41.55
RESET
  Top 0.406: RESET.P$2 | C8.2 80.59,41.67 79.86,40.94 79.86,39.88 | 79.86,39.88 79.86,33.43 79.84,33.42 R2.2 79.42,33.33 79.69,33.33 | U2.29 76.3,40.44 76.88,39.86 79.15,39.86 | 79.15,39.86 79.84,39.86 79.86,39.88 | 79.2,39.86 79.23,39.86 79.82,39.27 79.82,40.53 79.15,39.86 | 79.2,33.72 79.86,34.37 79.86,34.42 80.97,33.3 80.97,33.22 80.97,33.21 79.58,33.21 79.69,33.33 | 79.69,33.33 79.69,33.8 79.76,33.86 80,33.86
  Top 0.813: 79.84,33.42 RESET.P$2
  Bottom 0.813: ISP.3 71.59,26.87 78.12,33.41 RESET.P$2
VDD  (1 unrouted)
  Top 0.254: L1.P$2 66.61,19.88 66.25,20.25
  Top 0.406: C18.2 R16.1 C20.2 C19.2
  Top 0.61: C18.2 62.79,20.08 R27.1 66.25,20.25 66.43,20.25 | U8.1 R4.1 52.81,18.15 52.29,18.15 | C6.2 52.29,18.15 | C19.2 57.02,17.13 56.48,16.59 C2.2 R25.2 R26.2 52.3,18.14 52.29,18.15 | R20.2 R19.2 70.02,11.5 70.02,18.29 68.43,19.88 L1.P$2 | 50.88,18.39 51.82,18.39 52.32,18.88 52.32,19.76 52.48,19.92 52.83,19.92 52.87,19.88 52.87,17.53 53.56,16.83 55.46,16.83 56.35,17.73 61.33,17.73 61.93,18.33 61.93,20.05 62.29,20.41 69.9,20.41 70.69,19.62 70.69,10.15 70.63,10.09 68.48,10.09 68.47,10.11 68.47,10.51 69.7,11.74 69.7,18.1 69.24,18.56 64.42,18.56 63.57,17.71 63.57,16.95 57.11,16.95 56.54,16.39 50.92,16.39 50.64,16.68 50.64,18.14 50.88,18.38 50.88,17.06 51.08,16.85 52.8,16.85 52.85,16.9 52.85,18.04 52.44,18.45 52.44,17.8 52.1,17.46
  Top 1.016: 52.1,17.46 51.27,17.46 51.25,17.44 51.25,17.08 51.63,16.7 56.05,16.7 56.62,17.27 61.78,17.27 62.42,17.91 62.42,19.59 62.52,19.69 69.53,19.69 70.17,19.05 70.17,11.08 69.67,10.58 69.67,10.79 70.21,11.32 70.21,17.62 69.04,18.79 63.33,18.79 63.3,18.76 63.3,17.77 63.1,17.58
VIN
  Top 0.254: 72.07,7.03 72.07,7 72.03,6.96
  Top 0.406: 58.75,8.53 63.24,8.53 63.63,8.92 64.48,8.92 64.89,9.32 65.12,9.32 65.47,8.97 70.79,8.97 73.53,6.23 76.91,6.23 78.39,7.71 78.39,11.79 82.28,11.79 82.28,7.62 78.15,3.49 73.62,3.49 73.17,3.03 73.17,1.86 70.21,1.86 70.21,6.59 69.47,7.33 59.15,7.33 58.75,7.74 58.75,8.53 59.16,8.12 59.16,7.69
  Top 0.6: U3.5 64.98,8.89
  Top 0.61: C11.2 C10.2 74.74,4.22 74.79,4.18 | C14.2 76.24,4.73 76.64,4.33 | C1.2 76.26,4.12 76.33,4.18 | 72.03,6.96 72.03,7.05 R20.1 R19.1 65.15,8.72 | 65.15,8.72 64.86,8.72 | 64.86,8.72 63.85,8.72 63.28,8.15 R18.1 62.39,8.18 R23.1 R24.1 | 65,8.87 64.86,8.72 | 64.98,8.89 65.15,8.72
  Top 0.813: 59.16,7.69 59.3,7.83 63.55,7.83 63.86,8.14 70.18,8.14 69.64,7.61 69.58,7.61 69.38,7.81 63.54,7.81 63.67,7.68 69.87,7.68 70.62,6.93 70.62,2.3 70.67,2.24 72.69,2.24 71.39,3.55 71.37,3.57 71.37,6.93 70.5,7.8 70.5,7.84 71.31,7.03 72.07,7.03 73.29,5.81 76.73,5.81 76.21,5.29 72.87,5.29 73.24,5.66 76.91,5.66 78.72,7.47 78.72,11.31 78.74,11.33 81.9,11.33 81.78,11.21 | 81.78,7.97 77.68,3.87 77.33,3.87 81.32,7.85 81.32,8.44 81.32,8.99 81.26,8.93 79.1,8.93 79.33,8.7 79.33,8.33
  Top 1.016: DC.VIN0 82.61,13.12 | 82.61,13.12 82.61,24.43 80.52,26.53 J1.1 | 82.28,11.79 82.61,12.12 82.61,13.12 | C14.2 78.8,5.92 81.32,8.44 | 81.78,7.97 81.78,8.02 81.47,8.32
  Top 1.27: 81.47,8.32 81.47,10.91 81.78,11.21 | D1.C 71.29,2.71 71.4,2.6 72.44,2.6 72.57,2.73 72.57,3.54 73.22,4.19 74.09,4.19 74.09,4.69 74.17,4.77 72.69,4.77 72.68,4.77 72.68,5.48 71.84,6.31 71.84,4.03 71.35,3.54 71.38,3.54 71.39,3.55
  Top 1.778: 74.79,4.18 76.33,4.18 76.5,4.18 76.64,4.33 80.41,8.09
XTAL1
  Top 0.406: U2.7 69,45.93 R1.2 68.81,47.97 Y1.1
XTAL2
  Top 0.406: U2.8 67.29,45.24 R1.1 66.83,46.57 Y1.3

### Text on the board
tPlace: NO | TX | DTR | COM | RX | GND | NC | 3V3 | MOSI | MISO | SCK | GND | RESET | U4 | VDD | GND | 3V3
bPlace: NO | Lora Relay v1.1 | www.makerfabs.com | COM | NC | RFM98W 433MHz | RFM95W 868MHz | RFM95W 915MHz